# Altium schematic sheet DACs.SchDoc: DACs
size Letter; Date: 2019-01-27; DocumentNumber: 5; Revision: C; SheetNumber: 5; SheetTotal: 7; ProjectTitle: SDRdrum Arty Shield; PageSetup: Record=PageOptions|CenterHorizontal=True|CenterVertical=True|PrintScale=0.98|XCorrection=1.00|YCorrection=1.00|PrintKind=2|BorderSize=5000000|LeftOffset=0|BottomOffset=0|Orientation=2|PaperLength=1000|PaperWidth=1000|Scale=100|PaperSource=7|PrintQuality=-3|MediaType=1|DitherType=10|PrintScaleMode=1|PaperKind=Tabloid|PaperIndex=3
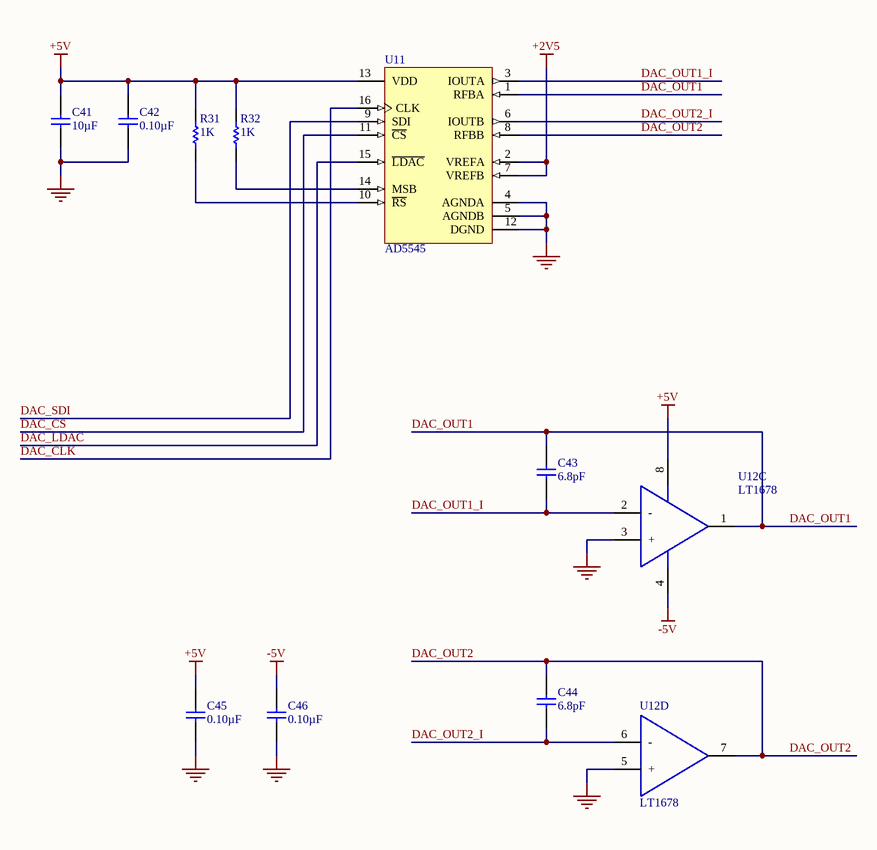
[diagram p0: DACs.SchDoc]

## Parts
C41  value 10µF  [CAP-0805-M]  (hidden comment: Capacitor)
C42  value 0.10µF  [CAP-0402-M]  (hidden comment: Capacitor)
C43  value 6.8pF  [CAP-0402-M]  (hidden comment: CAP 6.8pF ±0.5pF 50V 0402 C0G, NP0)
C44  value 6.8pF  [CAP-0402-M]  (hidden comment: CAP 6.8pF ±0.5pF 50V 0402 C0G, NP0)
C45  value 0.10µF  [CAP-0402-M]  (hidden comment: Capacitor)
C46  value 0.10µF  [CAP-0402-M]  (hidden comment: Capacitor)
R31  value 1K  [RES-0603-M]  (hidden comment: Resistor)
R32  value 1K  [RES-0603-M]  (hidden comment: Resistor)
U11  AD5545  [TSOP65P640X120-16N]
U12  LT1678  [SOIC127P600X175-8M]  (parts C,D of 4)

## Nets
+2V5: U11.2(VREFA) U11.7(VREFB)
+5V: C41.2 C42.1 C45.1 R31.1 R32.1 U11.13(VDD) U12.8(V+)
-5V: C46.1 U12.4(V-)
GND: C41.1 C42.2 C45.2 C46.2 U11.4(AGNDA) U11.5(AGNDB) U11.12(DGND) U12.3(+) U12.5(+)
DAC_CLK: U11.16(CLK)
DAC_CS: U11.11(~{CS})
DAC_LDAC: U11.15(~{LDAC})
DAC_OUT1: C43.2 U11.1(RFBA) U12.1(OUT1)
DAC_OUT1_I: C43.1 U11.3(IOUTA) U12.2(-)
DAC_OUT2: C44.2 U11.8(RFBB) U12.7(OUT1)
DAC_OUT2_I: C44.1 U11.6(IOUTB) U12.6(-)
DAC_SDI: U11.9(SDI)
NetR31_2: R31.2 U11.10(~{RS})
NetR32_2: R32.2 U11.14(MSB)

## Notes on the sheet
- Date:
- Revision:
- Sheet:
- /

## Library data of the parts
C41 = CC0805KKX5R6BB106: Manufacturer: Yageo; Manufacturer Series: CC; Tolerance: ±10%; Voltage: 10V; Temperature Coefficient: X5R; Part Number: CC0805KKX5R6BB106; Component Type: Standard; Package: 0805; Temperature Range: -55°C ~ 85°C; Supplier 1: Digi-Key; Supplier Part Number 1: 311-1460-1-ND
C42 C45 C46 = CC0402KRX5R6BB104: Manufacturer: Yageo; Manufacturer Series: CC; Tolerance: ±10%; Voltage: 10V; Temperature Coefficient: X5R; Part Number: CC0402KRX5R6BB104; Component Type: Standard; Package: 0402; Temperature Range: -55°C ~ 85°C; Supplier 1: Digi-Key; Supplier Part Number 1: 311-1336-1-ND
C43 C44 = CC0402DRNPO9BN6R8: Manufacturer: Yageo; Manufacturer Series: CC; Part Number: CC0402DRNPO9BN6R8; Component Type: Standard; Tolerance: ±0.5pF; Voltage: 50V; Package: 0402; Temperature Coefficient: C0G, NP0; Temperature Range: -55°C ~ 125°C; Supplier 1: Digi-Key; Supplier Part Number 1: 311-1637-1-ND
R31 R32 = RC0603FR-071KL: Manufacturer: Yageo; Manufacturer Series: RC; Tolerance: 1%; Power: 1/10 W; Temperature Coefficient: ±100ppm/°C; Part Number: RC0603FR-071KL; Component Type: Standard; Package: 0603; Temperature Range: -55°C ~ 155°C; Supplier 1: Digi-Key; Supplier Part Number 1: 311-1.00KHRCT-ND
U11 = AD5545: Dual, Current-Output, Serial-Input, 16-Bit DAC, 16-Pin TSSOP; Supplier 1: Digi-Key; Supplier Part Number 1: AD5545BRUZ-ND
U12 = LT1678: Dual/Quad Low Noise, Rail-to-Rail, Precision Op Amps, 8-Pin SOIC; Supplier 1: Digi-Key; Supplier Part Number 1: LT1678CS8#PBF-ND